# EAGLE schematic MicroMouseV0.0.2 (EAGLE 9.4.0)
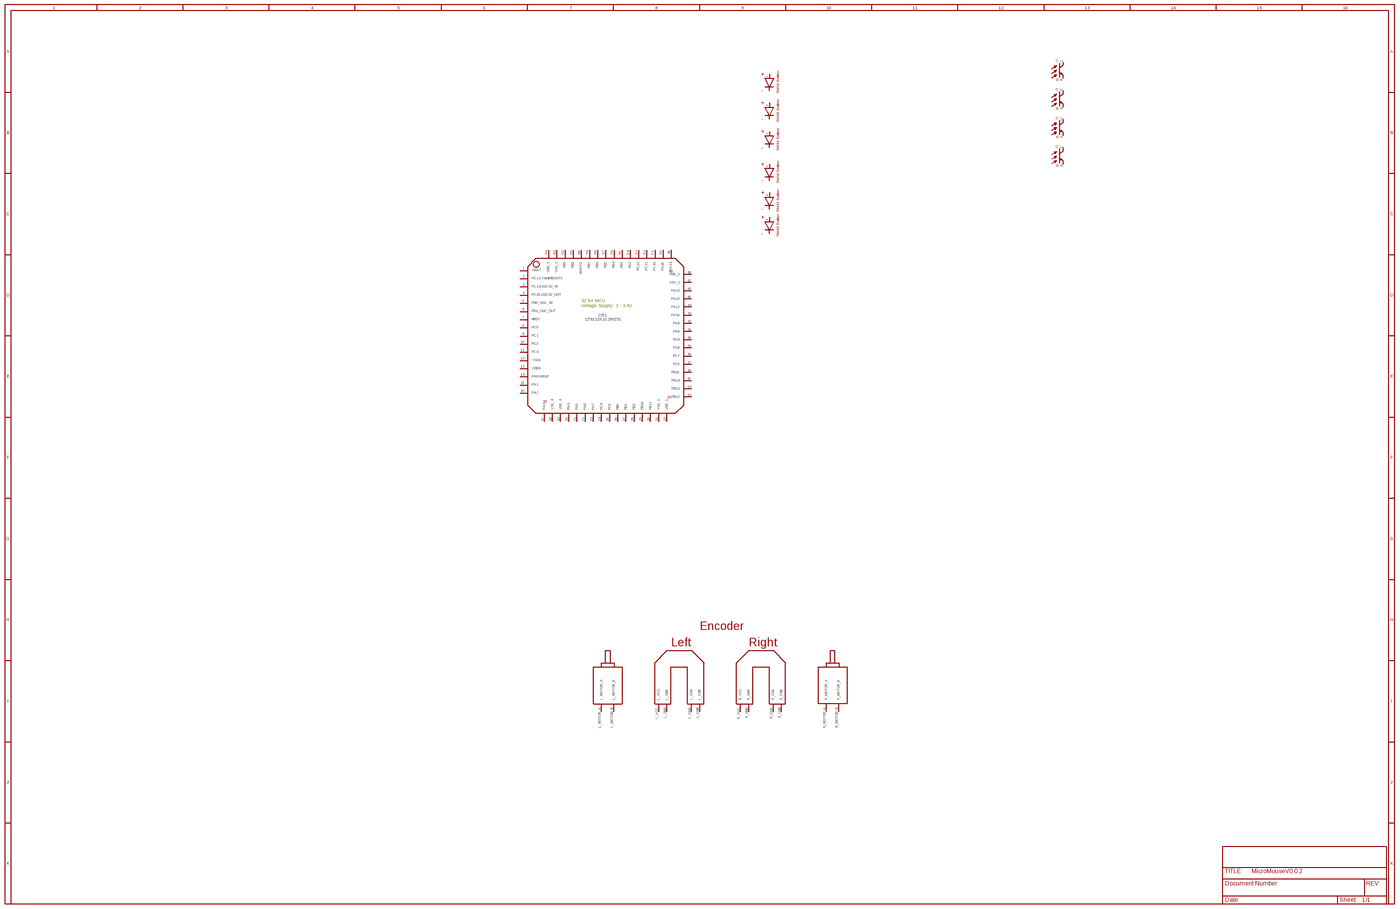
[diagram p0: schematic, sheet 1, overview]
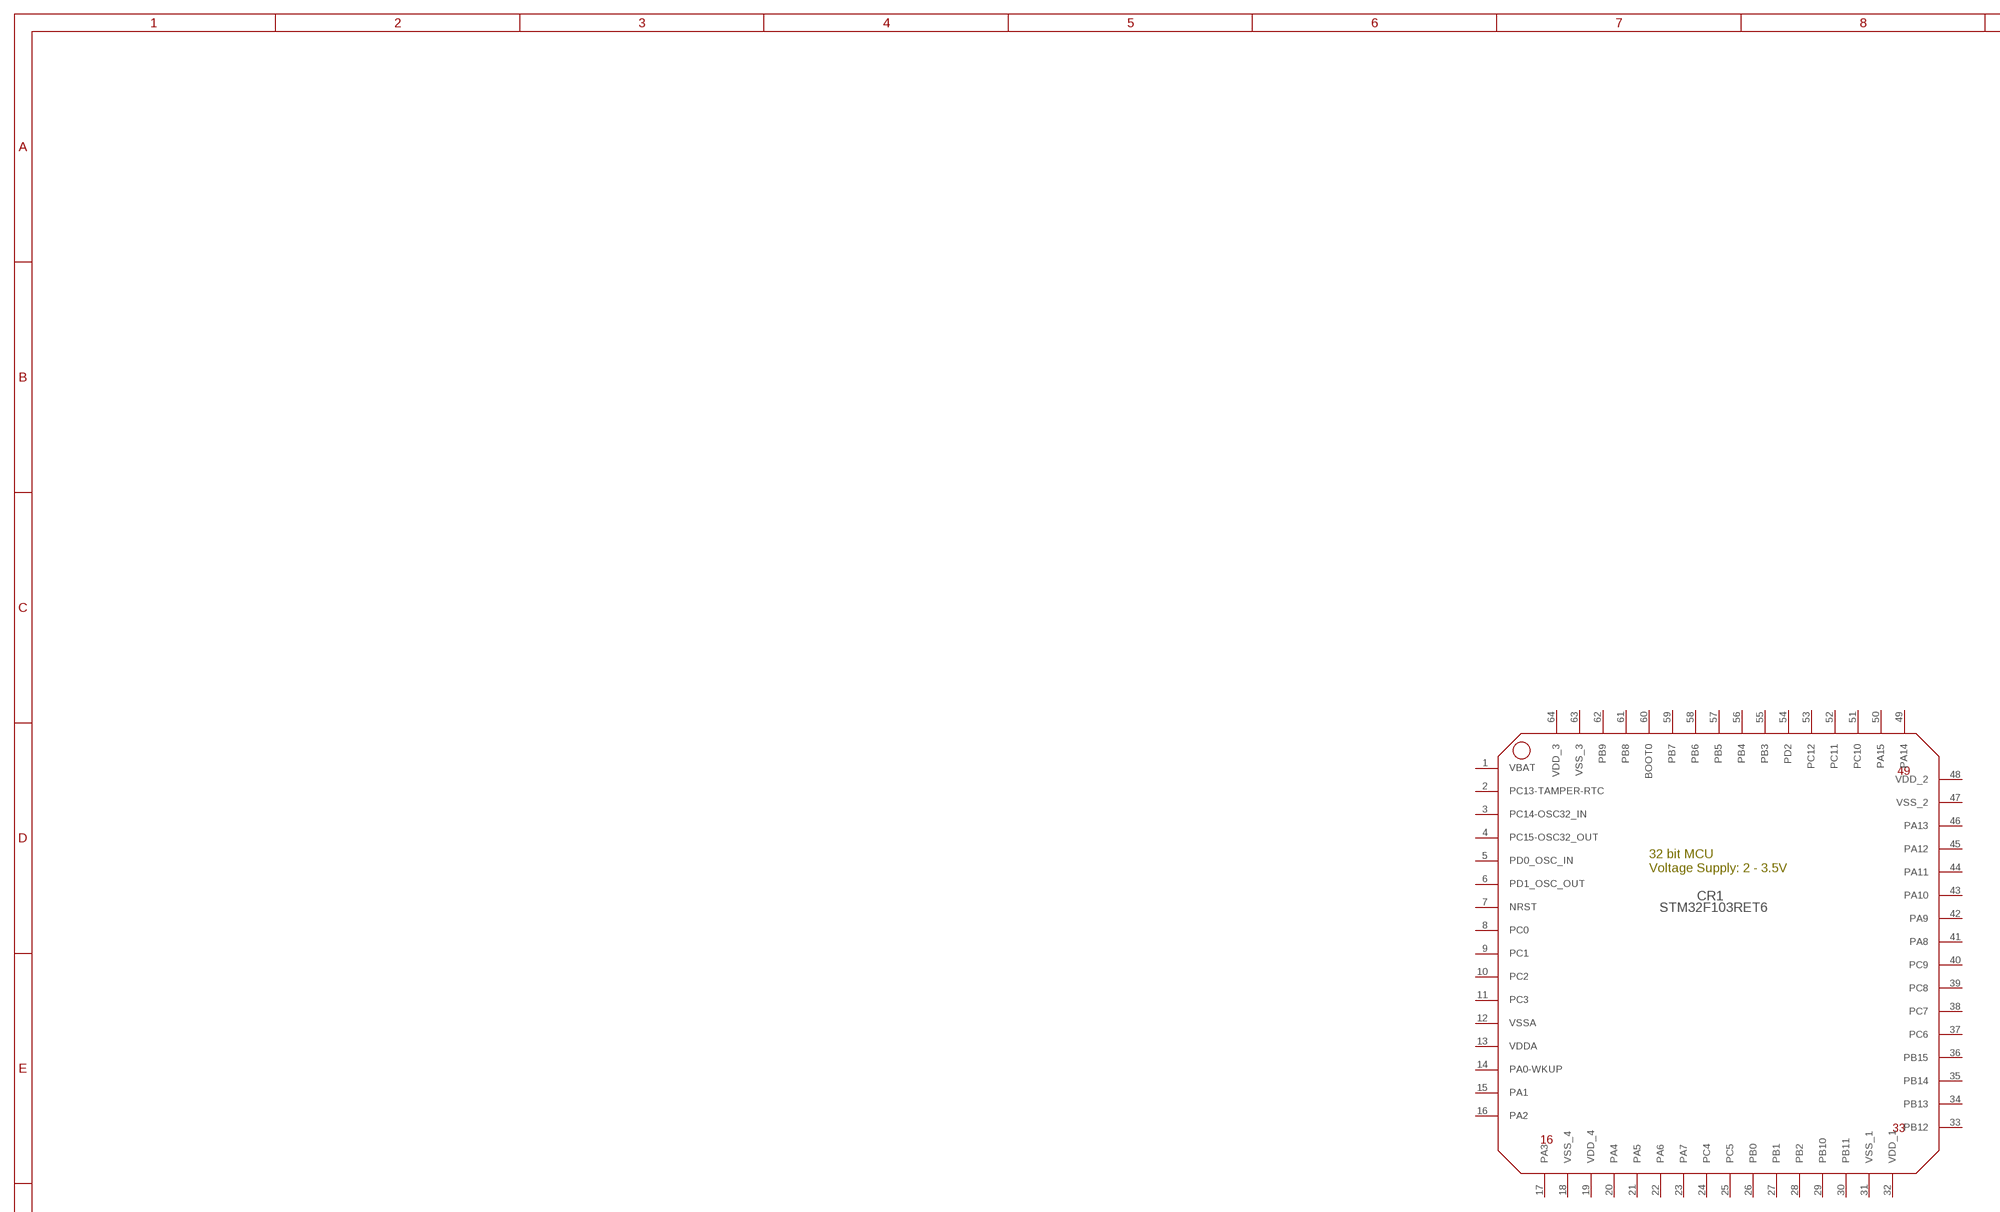
[diagram p1: schematic, sheet 1, part 1 of 4]
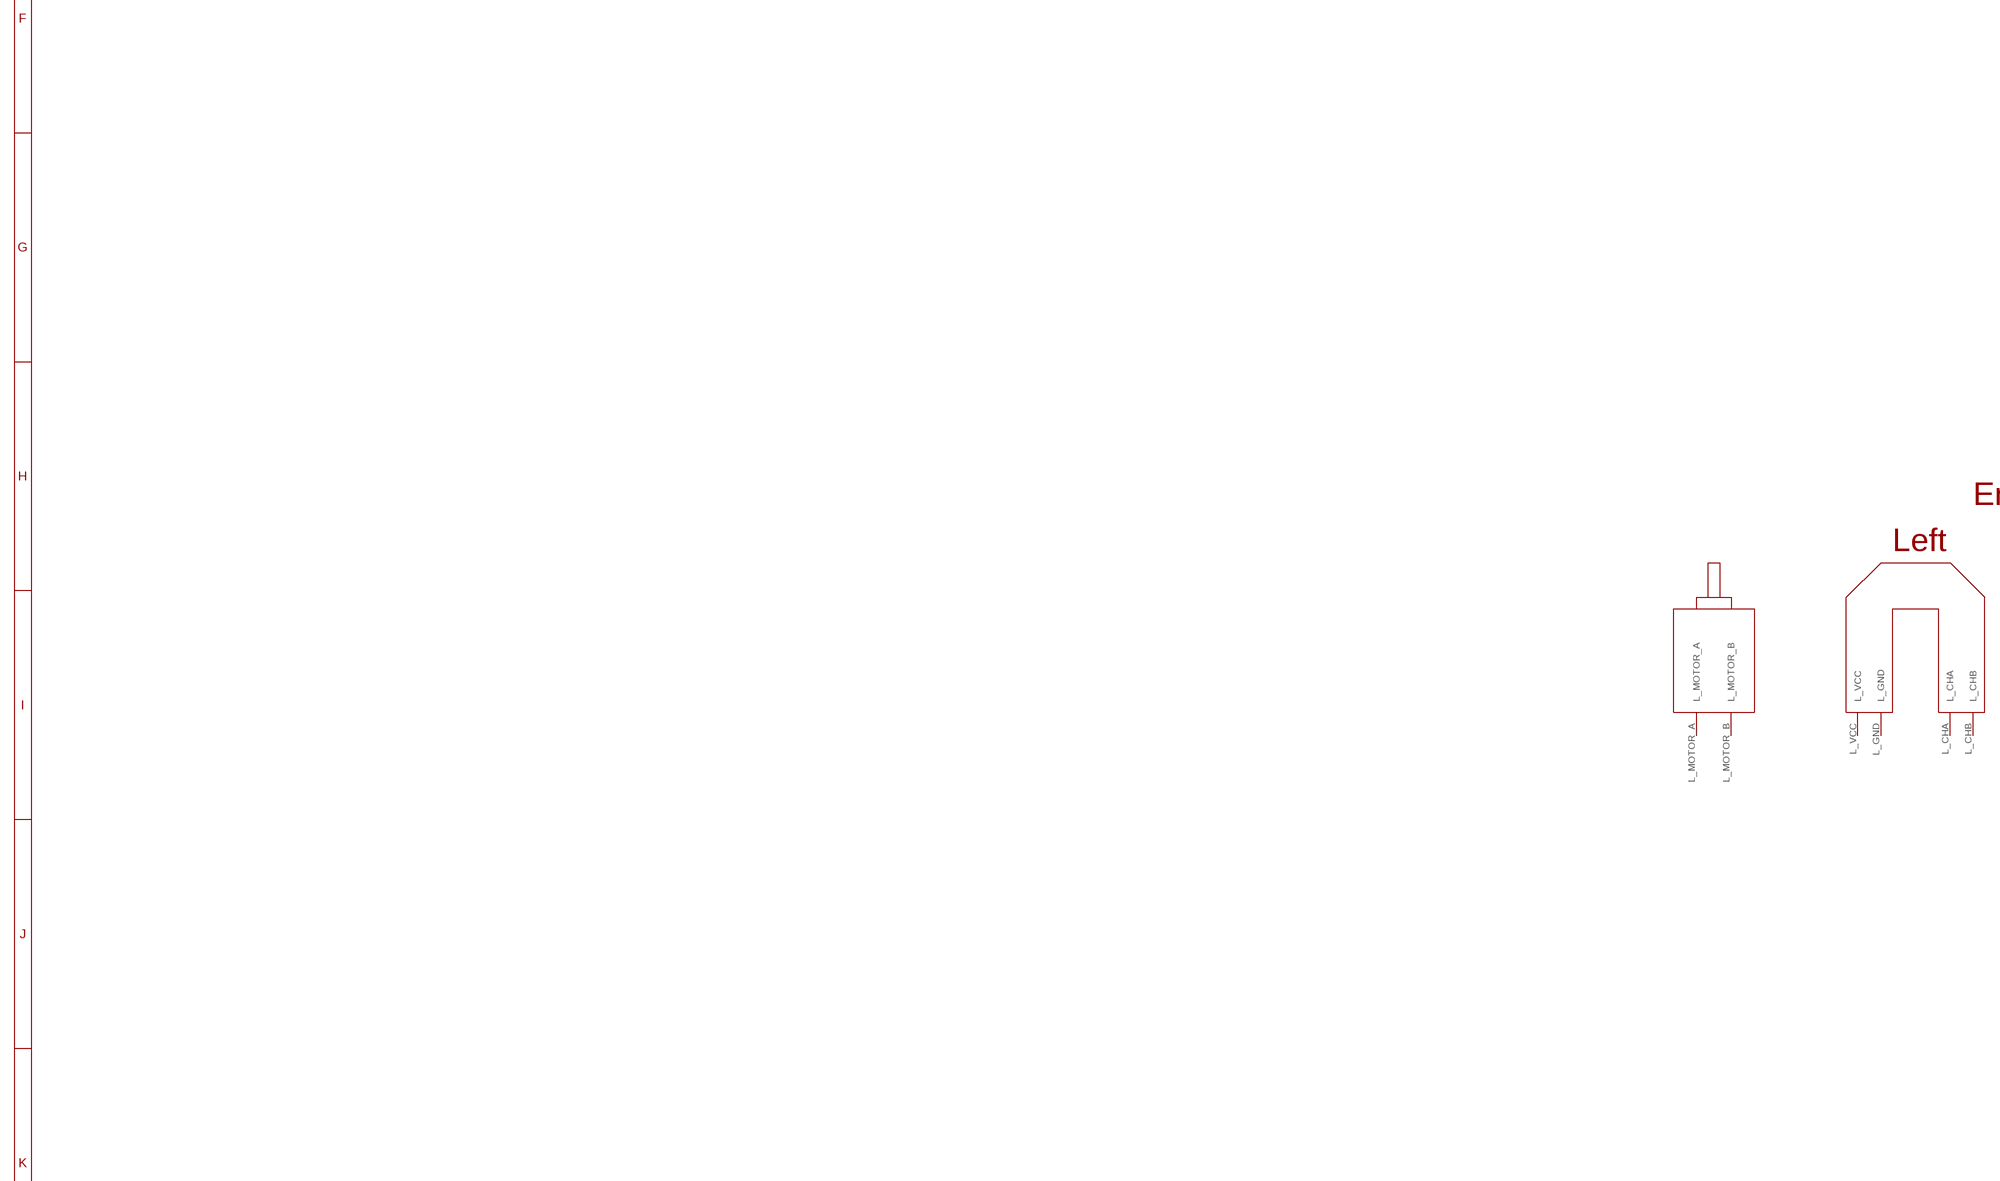
[diagram p2: schematic, sheet 1, part 2 of 4]
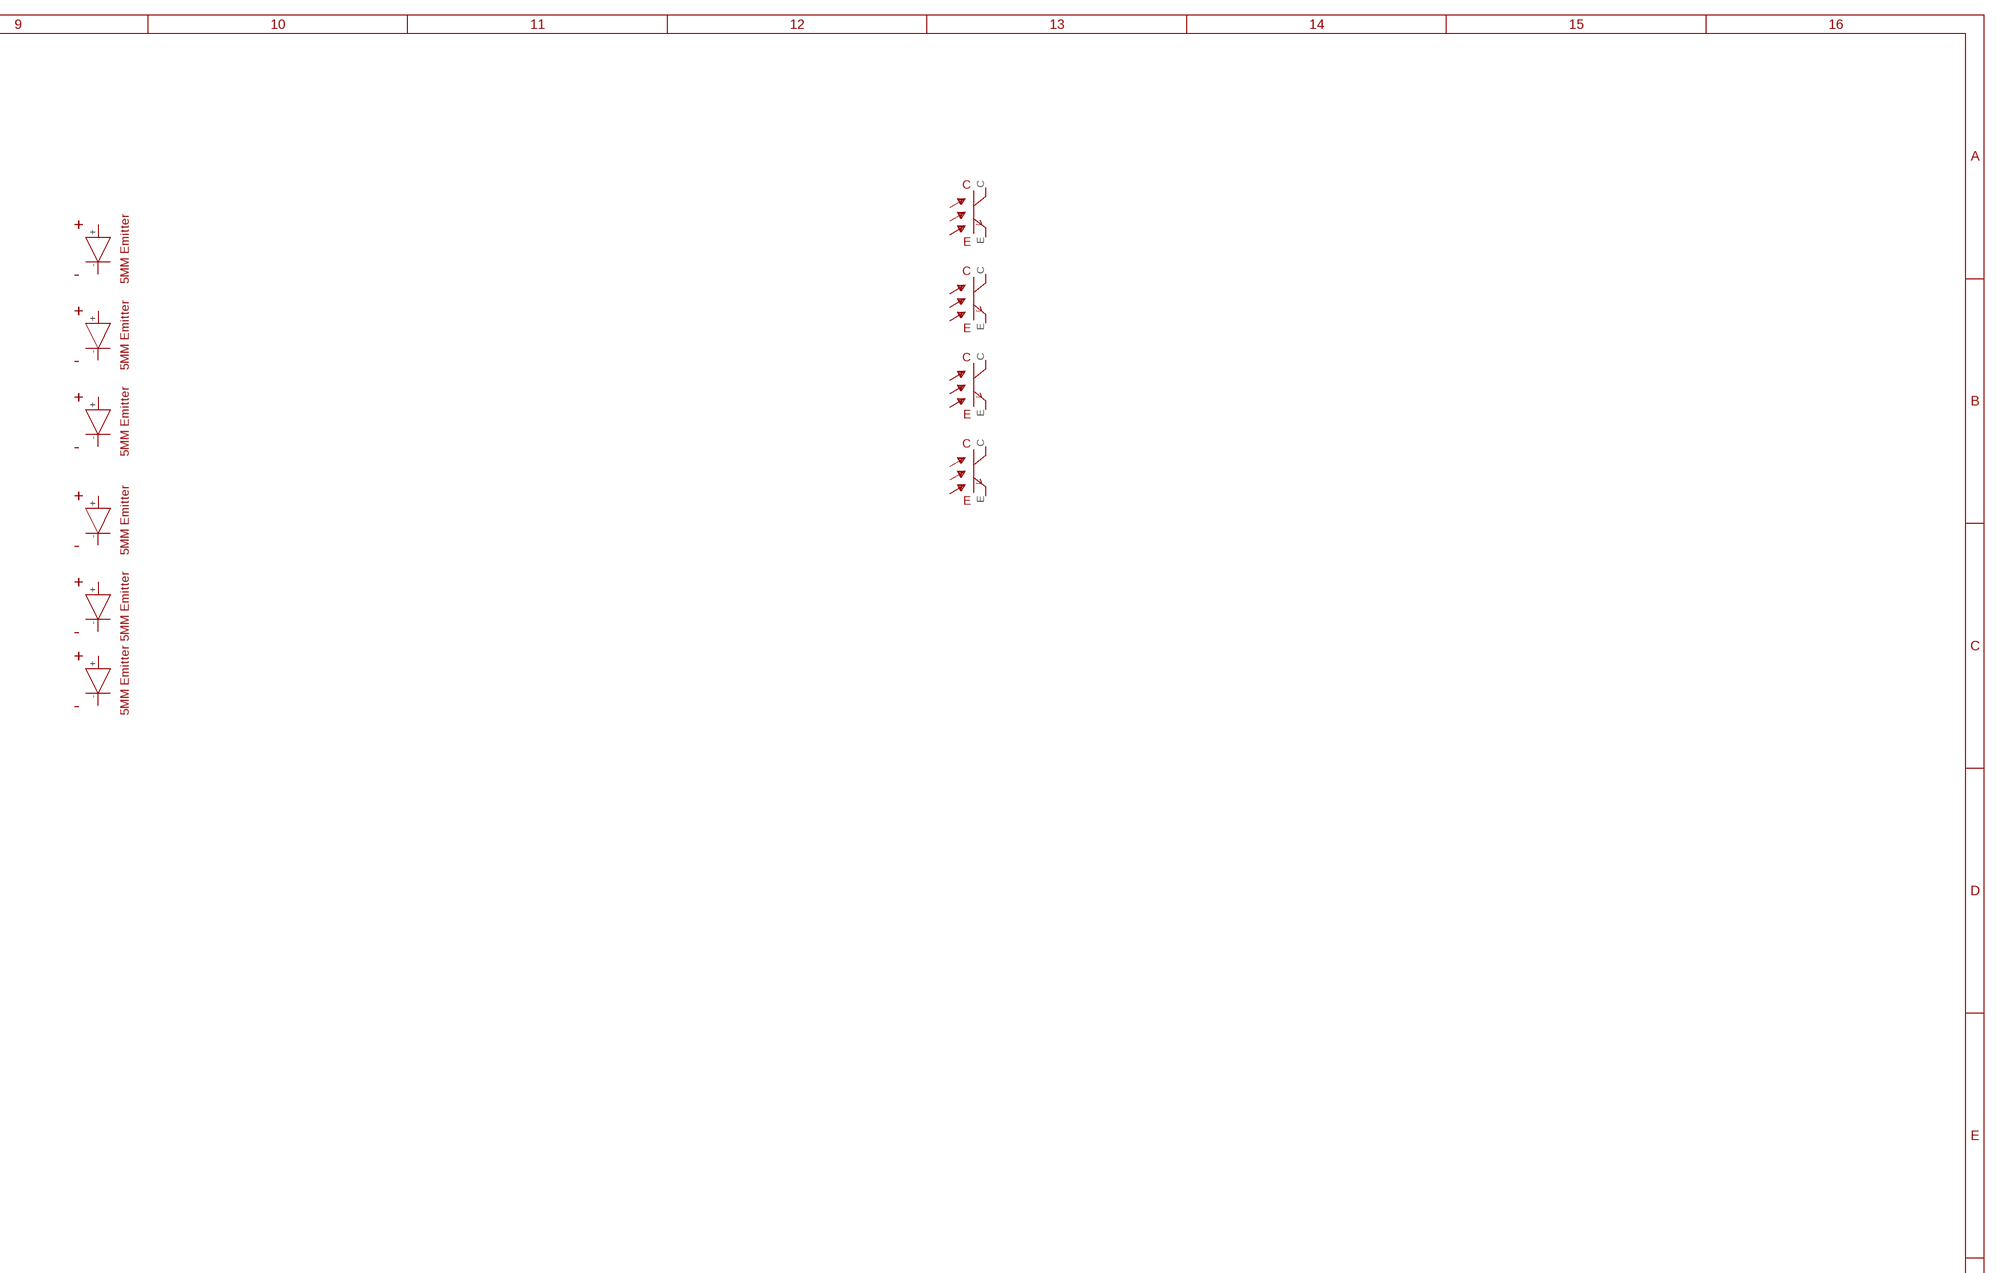
[diagram p3: schematic, sheet 1, part 3 of 4]
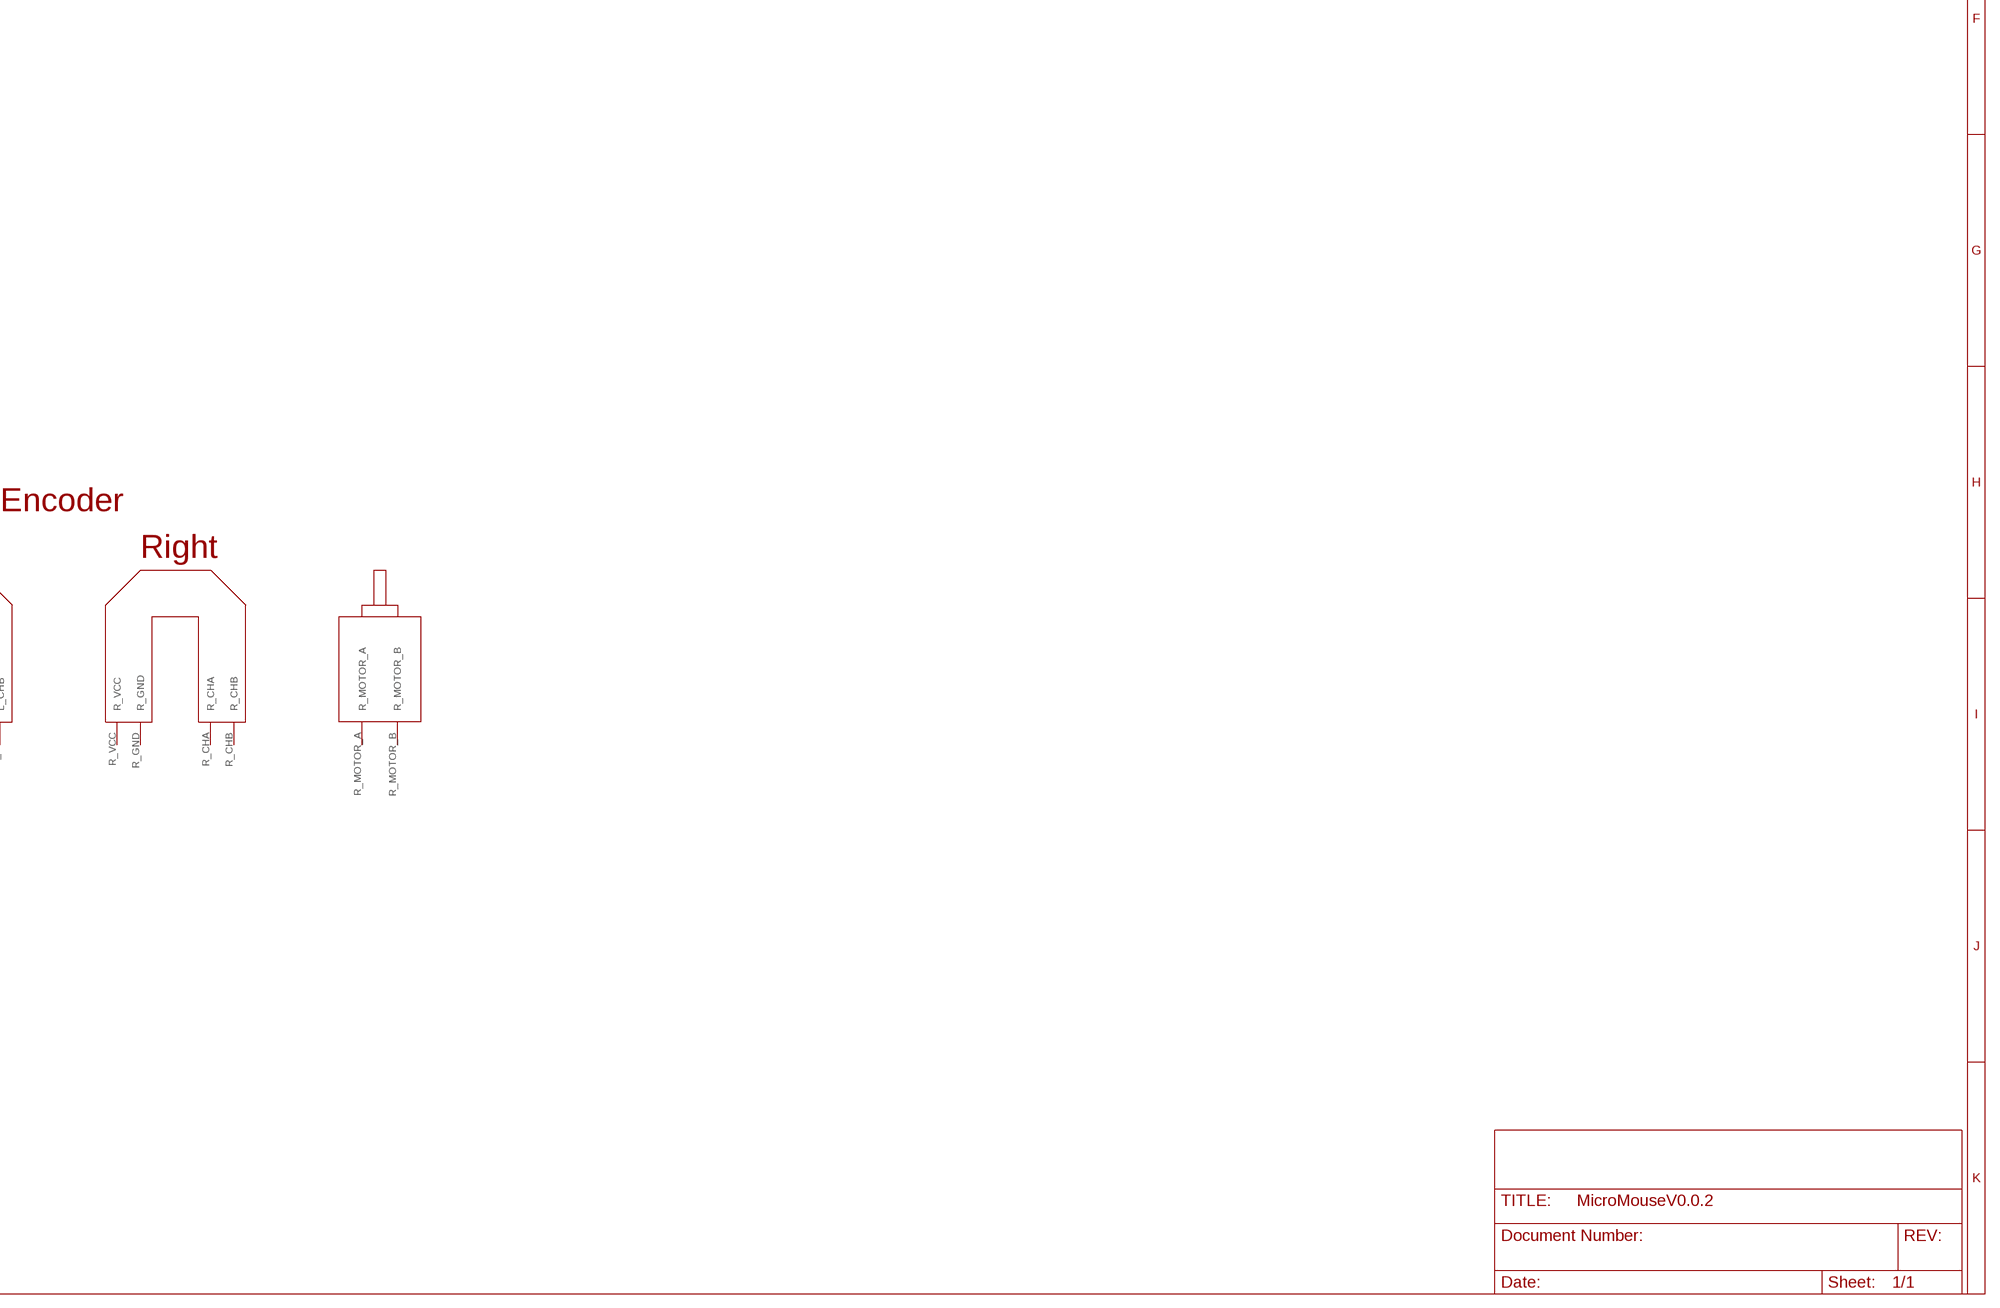
[diagram p4: schematic, sheet 1, part 4 of 4]

## Parts
CR1  STM32F103RET6  [LQFP-64]
U$1  EMITTER  [EMITTER]
U$2  EMITTER  [EMITTER]
U$3  EMITTER  [EMITTER]
U$4  EMITTER  [EMITTER]
U$5  EMITTER  [EMITTER]
U$6  EMITTER  [EMITTER]
U$7  RECEIVER  [RECEIVER]
U$8  RECEIVER  [RECEIVER]
U$9  RECEIVER  [RECEIVER]
U$10  RECEIVER  [RECEIVER]
U$11  FUTURA_V1.0_MOTOR_MOUNT  [FUTURA_V1.0_MOTOT_MOUNT]
Unconnected: CR1.2(PC13-TAMPER-RTC) CR1.3(PC14-OSC32_IN) CR1.4(PC15-OSC32_OUT) CR1.5(PD0_OSC_IN) CR1.6(PD1_OSC_OUT) CR1.7(NRST) CR1.8(PC0) CR1.9(PC1) CR1.10(PC2) CR1.11(PC3) CR1.14(PA0-WKUP) CR1.15(PA1) CR1.16(PA2) CR1.17(PA3) CR1.20(PA4) CR1.21(PA5) CR1.22(PA6) CR1.23(PA7) CR1.24(PC4) CR1.25(PC5) CR1.26(PB0) CR1.27(PB1) CR1.28(PB2) CR1.29(PB10) CR1.30(PB11) CR1.33(PB12) CR1.34(PB13) CR1.35(PB14) CR1.36(PB15) CR1.37(PC6) CR1.38(PC7) CR1.39(PC8) CR1.40(PC9) CR1.41(PA8) CR1.42(PA9) CR1.43(PA10) CR1.44(PA11) CR1.45(PA12) CR1.46(PA13) CR1.49(PA14) CR1.50(PA15) CR1.51(PC10) CR1.52(PC11) CR1.53(PC12) CR1.54(PD2) CR1.55(PB3) CR1.56(PB4) CR1.57(PB5) CR1.58(PB6) CR1.59(PB7) CR1.60(BOOT0) CR1.61(PB8) CR1.62(PB9) U$1.+ U$1.- U$2.+ U$2.- U$3.+ U$3.- U$4.+ U$4.- U$5.+ U$5.- U$6.+ U$6.- U$7.C U$7.E U$8.C U$8.E U$9.C U$9.E U$10.C U$10.E U$11.L_CHA U$11.L_CHB U$11.L_GND U$11.L_MOTOR_A U$11.L_MOTOR_B U$11.L_VCC U$11.R_CHA U$11.R_CHB U$11.R_GND U$11.R_MOTOR_A U$11.R_MOTOR_B U$11.R_VCC

## Notes on the sheet
- 32 bit MCU
  Voltage Supply: 2 - 3.5V

## Power pins joined to a net without a drawn wire
VBAT: CR1.1(VBAT)
VDD_1: CR1.32(VDD_1)
VDD_2: CR1.48(VDD_2)
VDD_3: CR1.64(VDD_3)
VDD_4: CR1.19(VDD_4)
VDDA: CR1.13(VDDA)
VSS_1: CR1.31(VSS_1)
VSS_2: CR1.47(VSS_2)
VSS_3: CR1.63(VSS_3)
VSS_4: CR1.18(VSS_4)
VSSA: CR1.12(VSSA)

## Library data of the parts
CR1 = STM32F103:STM32F103RET6; MANUFACTURER_PART_NUMBER: STM32F103RET6; VENDOR: STMicroelectronics
U$1-U$6 = chok_boi:EMITTER
U$7-U$10 = chok_boi:RECEIVER
U$11 = chok_boi:FUTURA_V1.0_MOTOR_MOUNT